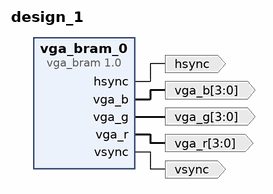
[diagram p0: block diagram of the top level]
# Vivado block design design_1, xc7z007sclg400-1, Vivado 2019.1
create_bd_design design_1

create_bd_port -dir O hsync
create_bd_port -dir O vsync
create_bd_port -dir O -from 3 -to 0 vga_r
create_bd_port -dir O -from 3 -to 0 vga_g
create_bd_port -dir O -from 3 -to 0 vga_b

create_bd_cell -type ip -vlnv xilinx.com:user:vga_bram:1.0 vga_bram_0

# ---- connections ----

connect_bd_net [get_bd_pins vga_bram_0/hsync] [get_bd_ports hsync]
connect_bd_net [get_bd_pins vga_bram_0/vsync] [get_bd_ports vsync]
connect_bd_net [get_bd_pins vga_bram_0/vga_r] [get_bd_ports vga_r]
connect_bd_net [get_bd_pins vga_bram_0/vga_g] [get_bd_ports vga_g]
connect_bd_net [get_bd_pins vga_bram_0/vga_b] [get_bd_ports vga_b]

validate_bd_design
save_bd_design
